# EasyEDA Pro project ProPrj_digisparkI2C_module_2026-01-09.epro

# Schematic Schematic1
Board Name: Board1; Create Date: 2026-01-06; Page Name: P1; Project Name: digisparkI2C_module; Schematic Name: Schematic1; Update Date: 2026-01-08; Company: EasyEDA.com; Page Size: A4; Version: V1.0
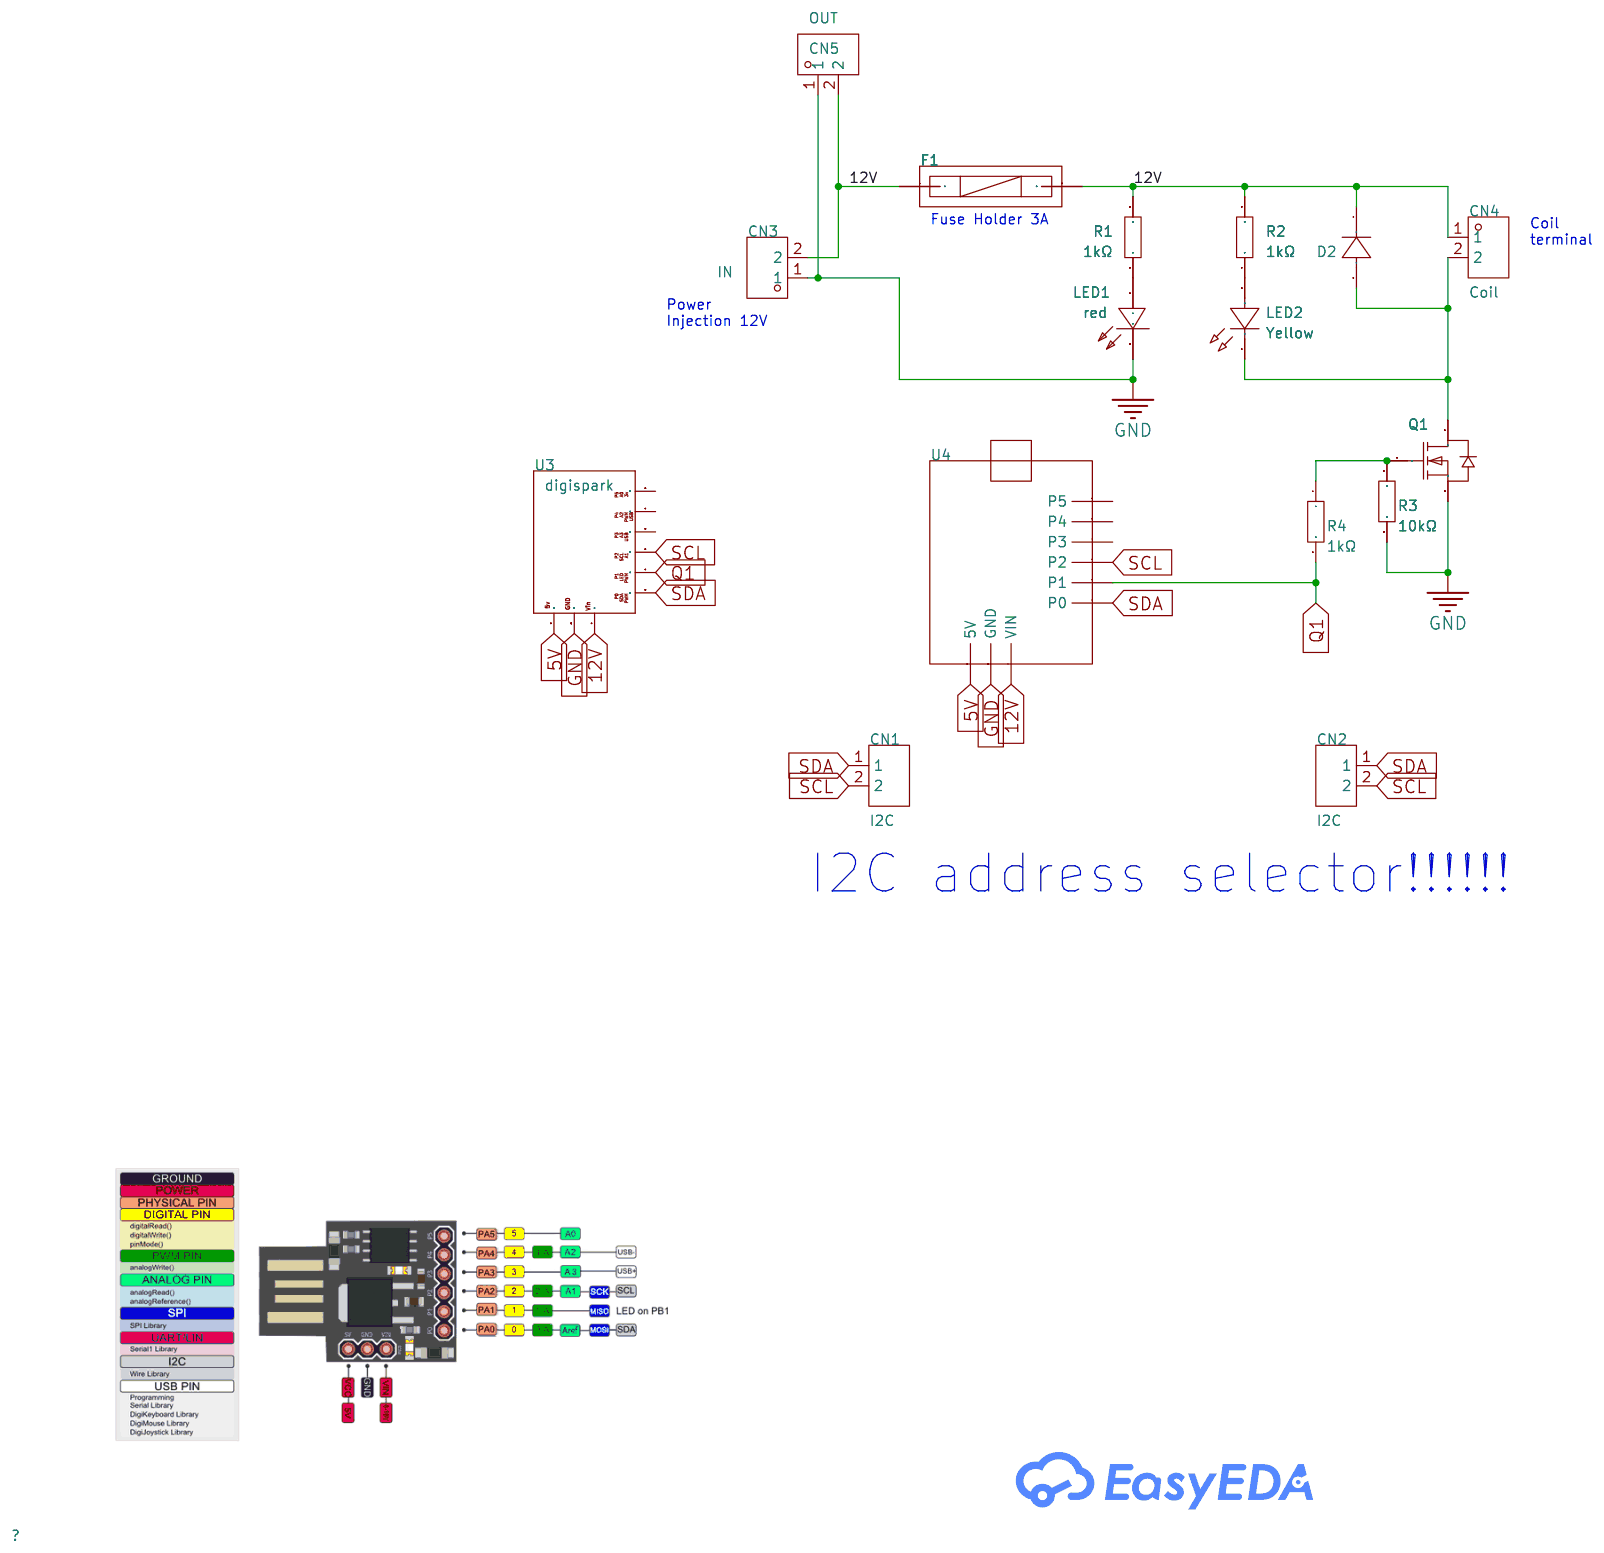
[diagram p0: schematic sheet]

## Parts
CN1  I2C  [CONN-TH_2P-P2.50_XY-XH2.54-2A11-YT]
CN2  I2C  [CONN-TH_2P-P2.50_XY-XH2.54-2A11-YT]
CN3  IN  [CONN-TH_2P-P5.00_MX126-5.0-GN01-02P-CU-S-A]
CN4  Coil  [CONN-TH_2P-P5.00_MX126-5.0-GN01-02P-CU-S-A]
CN5  OUT  [CONN-TH_2P-P5.00_MX126-5.0-GN01-02P-CU-S-A]
D2  -  [SMA_L4.4-W2.8-LS5.4-RD]
F1  保险丝透明座  [FUSE-TH_L24.5-W9.8-P22.5]
LED1  red  [LED0805-R-RD-1]
LED2  Yellow  [LED0805-RD_YELLOW]
Q1  IRLZ44NPBF-HXY  [TO-220-3_L9.9-W4.5-P2.54-L-1]
R1  1kΩ  [R1206]
R2  1kΩ  [R1206]
R3  10kΩ  [R1206]
R4  1kΩ  [R1206]
U3  digispark  [DIGISPARK]  (no BOM)
U4  -  [ATtiny85 USB]

## Library data of the parts
CN1 CN2 = XY-XH2.54-2A11-YT: Pins Structure:1x2P Pitch:2.54mm Mounting Type:Through Hole Reference Series:XH Number of Pins:2P Number of Rows:1 Number of PINs Per Row:2 Row Spacing:- Current Rating:3A Contact Material:Copper Alloy Contact Plating:Tin Operating Temperature:-25℃~+85℃ O; LCSC Part Name: 1x2P 间距:2.54mm 直插 系列:XH; Supplier Part: C22391482; Manufacturer: XYECONN(辛译); Supplier Footprint: 插件,P=2.54mm; JLCPCB Part Class: Extended Part; Datasheet: https://item.szlcsc.com/datasheet/XY-XH2.54-2A11-YT/23969745.html; Supplier: LCSC; Pins Structure: 1x2P; Pitch: 2.54mm; Mounting Type: Through Hole; Reference Series: XH; Number of Pins: 2P; Number of Rows: 1; Number of PINs Per Row: 2; Current Rating: 3A; Contact Material: Copper Alloy; Contact Plating: Tin; Operating Temperature: -25℃~+85℃; Voltage Rating: 250V; Plastic Material: PA66; Flame Retardant Rating: UL94V-2; Color: Yellow
CN3-CN5 = MX126-5.0-02P-GN01-Cu-S-A: Number of Positions or Pins:1x2P Pitch:5mm Color:Green Mounting Type:Through Hole Number of Pins:2P Number of Rows:1 Number of PINs Per Row:2 Screw Specification:M2.5 Current Rating:10A Voltage Rating (Max):300V Wire Gauge - AWG:14~26 Wire Gauge - mm2:2.5; LCSC Part Name: 1x2P 5mm 直插 排数:1 每排P数:2; Supplier Part: C5188434; Manufacturer: MAX(迈旭); Supplier Footprint: 插件,P=5mm; JLCPCB Part Class: Extended Part; Datasheet: https://item.szlcsc.com/datasheet/MX126-5.0-02P-GN01-Cu-S-A/5862518.html; Supplier: LCSC; Number of Positions or Pins: 1x2P; Pitch: 5mm; Color: Green; Mounting Type: Through Hole; Number of Pins: 2P; Number of Rows: 1; Number of PINs Per Row: 2; Screw Specification: M2.5; Current Rating: 10A; Voltage Rating (Max): 300V; Wire Gauge - AWG: 14~26; Wire Gauge - mm2: 2.5; Operating Temperature: -40℃~+105℃
D2 = 1N4007: Supplier Footprint: SMA(DO-214AC); Supplier Part: C727081
F1 = 保险丝透明座: Fuseholder Type:- Fuse Type:- Fuse Size:-; LCSC Part Name: 两件套 保险丝座 5*20 透明座(两件套); Supplier Part: C58066; Manufacturer: xcfuse(旭程); JLCPCB Part Class: Extended Part; Datasheet: https://atta.szlcsc.com/upload/public/pdf/source/20201109/C58066_EF84FEEE40948BE1BD26BCA72E4FE443.pdf; Supplier: LCSC
LED1 = 17-21SURC/S530-A2/TR8: Illumination Color:Red; LCSC Part Name: 停产 红灯; Supplier Part: C131244; Manufacturer: EVERLIGHT(亿光); Supplier Footprint: 0805; JLCPCB Part Class: Extended Part; Supplier: LCSC; Illumination Color: Red
LED2 = YLED0805Y: Lamp Holder Type:- Illumination Color:Yellow Voltage - Forward(Vf):1.8V~2.4V Voltage - Forward(Vf):1.8V~2.4V Power(Watts):60mW Forward Current:20mA Wavelength - Dominant:584nm~596nm Wavelength - Dominant:584nm~596nm Peak Wavelength:598nm Diode Configurati; LCSC Part Name: 发光管; Supplier Part: C20608785; Manufacturer: YONGYUTAI(永裕泰); Supplier Footprint: 0805; JLCPCB Part Class: Extended Part; Datasheet: https://item.szlcsc.com/datasheet/YLED0805Y/21958292.html; Supplier: LCSC; Voltage - Forward(Vf): 1.8V~2.4V; Power(Watts): 60mW; Forward Current: 20mA; Wavelength - Dominant: 584nm~596nm; Peak Wavelength: 598nm; Luminous Intensity: 210mcd; Viewing Angle: 120°; Operating Temperature: -40℃~+85℃
Q1 = IRLZ44NPBF-HXY: Number:One N-channel Drain to Source Voltage:60V Current - Continuous Drain(Id):60A RDS(on):20mΩ@10V Pd - Power Dissipation:120W Gate Threshold Voltage (Vgs(th)):4V@250uA Gate Charge(Qg):39nC@10V Input Capacitance(Ciss):4.05nF Reverse Transfer Capacitance; LCSC Part Name: 1个N沟道 耐压:60V 电流:60A; Supplier Part: C22367197; Manufacturer: HXY MOSFET(华轩阳电子); Supplier Footprint: TO-220; JLCPCB Part Class: Extended Part; Datasheet: https://item.szlcsc.com/datasheet/IRLZ44NPBF-HXY/23837831.html; Supplier: LCSC; Number: One N-channel; Drain to Source Voltage: 60V; Current - Continuous Drain(Id): 60A; RDS(on): 20mΩ@10V; Pd - Power Dissipation: 120W; Gate Threshold Voltage (Vgs(th)): 4V@250uA; Gate Charge(Qg): 39nC@10V; Input Capacitance(Ciss): 4.05nF; Reverse Transfer Capacitance (Crss@Vds): 110pF; Operating Temperature: -55℃~+150℃; Type: N-Channel; Output Capacitance(Coss): 430pF
R1-R4 = Res_1206: Supplier Footprint: 1206
U3 = DIGISPARK_
U4 = Digispark Attiny85 (with pin headers)

## Nets
5V: U3.5V U4.9(5V)
12V: CN3.2 CN4.1 CN5.2 D2.1(K) F1.1 F1.2 R1.2 R2.2 U3.VIN U4.7(VIN)
GND: CN3.1 CN5.1 LED1.2(K) Q1.3(S) R3.2 U3.GND U4.8(GND)
Q1: R4.2 U3.P1 U4.2(P1)
SCL: CN1.2 CN2.2 U3.P2 U4.3(P2)
SDA: CN1.1 CN2.1 U3.P0 U4.1(P0)
$1N2753: LED1.1(A) R1.1
$1N3111: LED2.2(A) R2.1
$1N3163: Q1.1(G) R3.1 R4.1
Net-(CN4-2): CN4.2 D2.2(A) LED2.1(K) Q1.2(D)

Not connected (* = marked no-connect by the designer): U3 P3 P4 P5; U4 4(P3) 5(P4) 6(P5)

## Notes on the sheet
- Fuse Holder 3A
- Coil
  terminal
- Power
  Injection 12V
- I2C address selector!!!!!!

# Board PCB1
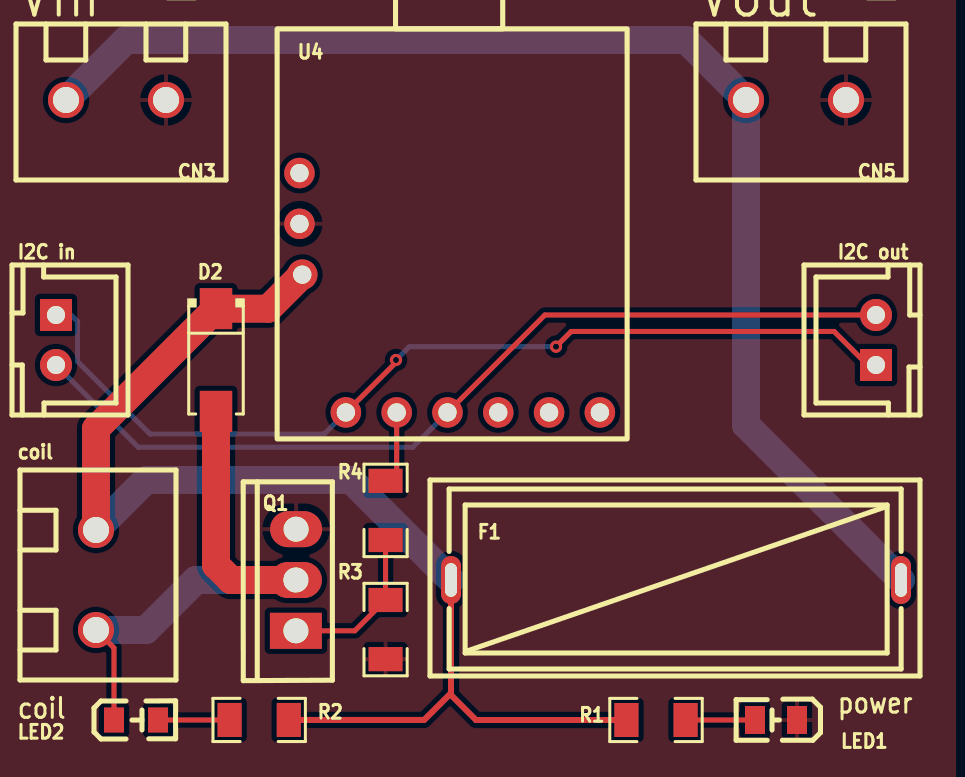
[diagram p1: board, top side]
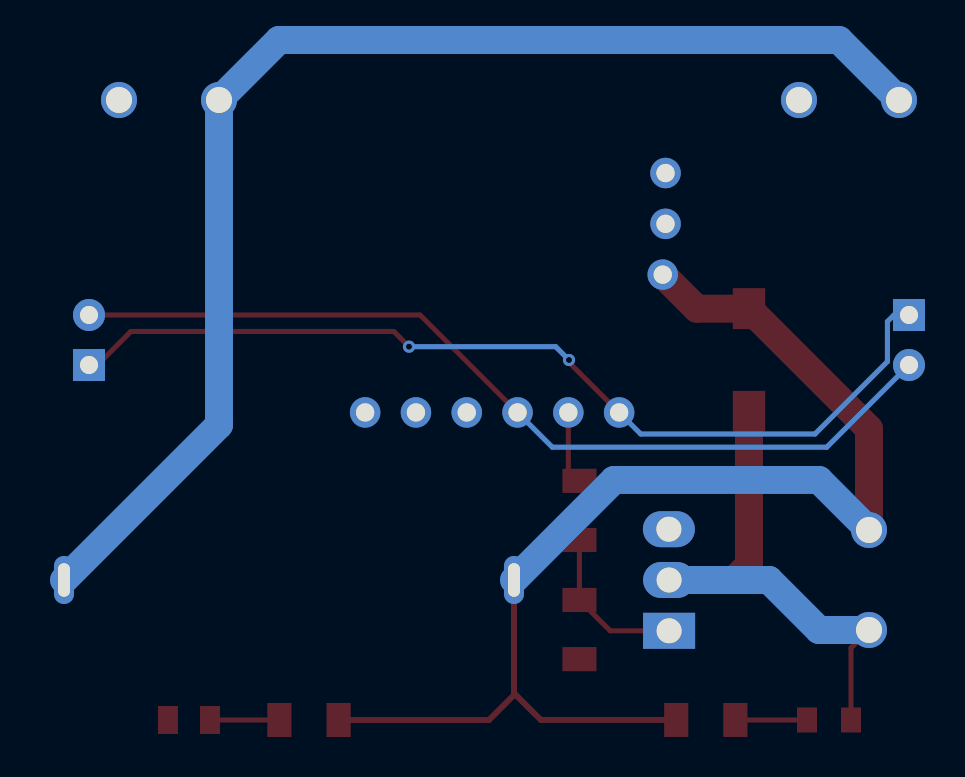
[diagram p2: board, bottom side, seen from below]

No outline. copper layers: Top Layer, Bottom Layer. Coordinates in mm from the lowest, leftmost part position.
Stack: Top Layer 0.035mm / Dielectric1 1.51mm FR4 er 4.5 / Bottom Layer 0.035mm

## Design rules (mm)
template: Custom Config
spacing copperThickness1oz (default): track to track 0.102, other pairs 0.152 to 0.3
spacing copperThickness2oz: track to track 0.203, other pairs 0.152 to 0.3
track width copperThickness1oz (default): min 0.127, default 0.254, max 2.54
track width copperThickness2oz: min 0.203, default 0.254, max 2.54
track width PowerNET: min 1.27, default 1.397, max 2.54
differential pair differentialPair (default): width min 0.127, default 0.254, max 2.54; gap min 0.152, default 0.152
via viaSize (default): diameter min 0.5, default 0.61, max 10; hole min 0.3, default 0.305, max 6.3
net 12V uses PowerNET
net GND uses PowerNET

## Placement (name value [footprint] x y rotation side)
CN3  IN  [CONN-TH_2P-P5.00_MX126-5.0-GN01-02P-CU-S-A]  3 31 180 top
CN5  OUT  [CONN-TH_2P-P5.00_MX126-5.0-GN01-02P-CU-S-A]  37 31 180 top
coil  Coil  [CONN-TH_2P-P5.00_MX126-5.0-GN01-02P-CU-S-A]  2 7 270 top
D2  -  [SMA_L4.4-W2.8-LS5.4-RD]  8 18 270 top
F1  保险丝透明座  [FUSE-TH_L24.5-W9.8-P22.5]  31 7 0 top
I2C in  I2C  [CONN-TH_2P-P2.50_XY-XH2.54-2A11-YT]  0 19 270 top
I2C out  I2C  [CONN-TH_2P-P2.50_XY-XH2.54-2A11-YT]  41 19 90 top
LED1  red  [LED0805-R-RD-1]  36 0 180 top
LED2  Yellow  [LED0805-RD_YELLOW]  4 0 0 top
Q1  IRLZ44NPBF-HXY  [TO-220-3_L9.9-W4.5-P2.54-L-1]  12 7 90 top
R1  1kΩ  [R1206]  30 0 180 top
R2  1kΩ  [R1206]  10.16 0 0 top
R3  10kΩ  [R1206]  16.48 4.52 270 top
R4  1kΩ  [R1206]  16.48 10.48 90 top
U4  -  [ATtiny85 USB]  17 39 270 top

## Footprints (pads in the part's own frame, mm; a bottom-side part is the same pattern mirrored in y, then rotated)
ATtiny85 USB
  round 1.524 hole 0.914: 1(23.622,-2.507) 2(23.622,0.033) 3(23.622,2.573) 4(23.622,5.113) 5(23.622,7.653) 6(23.622,10.193) 7(16.732,-4.687) 8(14.192,-4.826) 9(11.652,-4.826)
CONN-TH_2P-P2.50_XY-XH2.54-2A11-YT
  rect 1.6x1.6 hole 0.9: 1(-1.25,0)
  round 1.6 hole 0.9: 2(1.25,0)
CONN-TH_2P-P5.00_MX126-5.0-GN01-02P-CU-S-A
  round 1.8 hole 1.3: 1(-2.5,0) 2(2.5,0)
FUSE-TH_L24.5-W9.8-P22.5
  oval 1x2.4 hole 0.6x1.68: 1(-11.25,0) 2(11.25,0)
LED0805-R-RD-1
  rect 1x1.399 smd: 1(1.05,0) 2(-1.05,0)
LED0805-RD_YELLOW
  rect 1x1.25 smd: 1(-1.1,0) 2(1.1,0)
R1206
  rect 1.208x1.701 smd: 1(-1.479,0) 2(1.479,0)
SMA_L4.4-W2.8-LS5.4-RD
  rect 2.046x1.62 smd: 1(-2.566,0) 2(2.566,0)
TO-220-3_L9.9-W4.5-P2.54-L-1
  rect 1.8x2.6 hole 1.25: 1(-2.54,0.005)
  oval 1.8x2.6 hole 1.25: 2(0,0.005) 3(2.54,-0.005)

## Nets
5V: U4.9
12V: CN3.2 CN5.2 coil.1 D2.1 F1.1 F1.2 R1.2 R2.2 U4.7
GND: CN3.1 CN5.1 LED1.2 Q1.3 R3.2 U4.8
Q1: R4.2 U4.2
SCL: I2C in.2 I2C out.2 U4.3
SDA: I2C in.1 I2C out.1 U4.1
$1N2627: coil.2 D2.2 LED2.1 Q1.2
$1N2753: LED1.1 R1.1
$1N3111: LED2.2 R2.1
$1N3163: Q1.1 R3.1 R4.1

Pads without a net: U4 4 5 6

## Via types
v1: diameter 0.61, hole 0.305, Top Layer to Bottom Layer, 2 vias

## Routing (per net, layer and track width the routed paths; a pad name or vN(x,y) marks a point on that pad's centre or on a via; arc(x,y) is an arc through that point)
12V: length 126.8
  Top Layer w0.3: 19.75,1.35 19.75,1.25 21,0 R1.2 ; 19.75,1.35 18.41,0 R2.2 ; 19.75,1.35 F1.1
  Top Layer w1.397: coil.1 2,14.57 D2.1 10.61,20.57 U4.7
  Bottom Layer w1.397: CN3.2 3.5,34 31.5,34 CN5.2 34.5,14.75 F1.2 ; F1.1 14.75,12 4.5,12 coil.1
Q1: length 3.6
  Top Layer w0.254: R4.2 17.03,12.51 U4.2
SCL: length 45.4
  Top Layer w0.254: U4.3 24.44,20.25 I2C out.2
  Bottom Layer w0.254: I2C in.2 4.11,13.64 17.83,13.64 U4.3
SDA: length 47.5
  Top Layer w0.254: U4.1 17,17.89 v1(17,18) ; v1(25,18.67) 25.76,19.43 38.9,19.43 40.58,17.75 I2C out.1
  Bottom Layer w0.254: U4.1 13.41,14.3 4.7,14.3 1.08,17.92 1.08,19.92 0.75,20.25 I2C in.1 ; v1(25,18.67) 17.67,18.67 v1(17,18)
$1N2627: length 27.9
  Top Layer w0.254: LED2.1 2.9,3.6 coil.2
  Top Layer w1.4: D2.2 8,7.75 8.75,7 Q1.2
  Bottom Layer w1.4: Q1.2 7,7 4.5,4.5 coil.2
$1N2753: length 3.5
  Top Layer w0.254: R1.1 LED1.1
$1N3111: length 3.6
  Top Layer w0.254: 8.68,0 8.68,0 LED2.2
$1N3163: length 8.1
  Top Layer w0.254: R4.1 R3.1 14.94,4.46 Q1.1

## Copper pours and planes (outline as drawn; the poured copper is in the pictures)
GND on Top Layer: -4,39 45,39 45,-4 -4,-4

## Text on the board
Top Silkscreen Layer: power | coil | Vin | - | Vout
